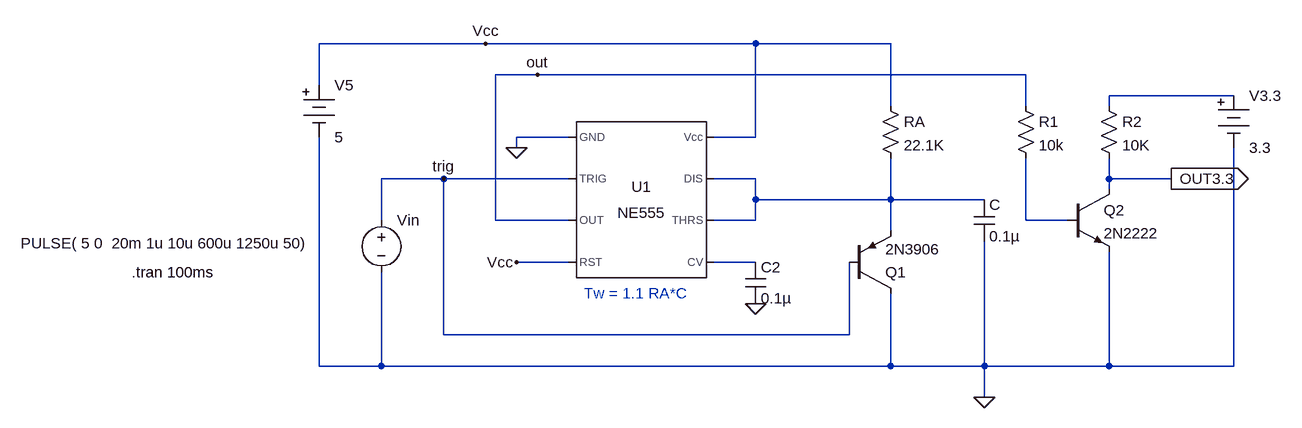
[diagram p0: schematic interface audio morse.asc]
interface audio morse.asc, the LTspice schematic file:
Version 4
SHEET 1 1524 1016
WIRE -96 -80 -352 -80
WIRE 320 -80 -96 -80
WIRE 528 -80 320 -80
WIRE -16 -32 -80 -32
WIRE 736 -32 -16 -32
WIRE -352 -16 -352 -80
WIRE 1056 0 864 0
WIRE 528 16 528 -80
WIRE 736 16 736 -32
WIRE 864 16 864 0
WIRE 32 64 -48 64
WIRE 320 64 320 -80
WIRE 320 64 256 64
WIRE -48 80 -48 64
WIRE -160 128 -256 128
WIRE 32 128 -160 128
WIRE 320 128 256 128
WIRE 864 128 864 96
WIRE 960 128 864 128
WIRE 864 144 864 128
WIRE 320 160 320 128
WIRE 528 160 528 96
WIRE 528 160 320 160
WIRE 672 160 528 160
WIRE -256 192 -256 128
WIRE -80 192 -80 -32
WIRE 32 192 -80 192
WIRE 320 192 320 160
WIRE 320 192 256 192
WIRE 736 192 736 96
WIRE 800 192 736 192
WIRE 528 208 528 160
WIRE 32 256 -48 256
WIRE 320 256 256 256
WIRE -160 368 -160 128
WIRE 464 368 464 256
WIRE 464 368 -160 368
WIRE -352 416 -352 64
WIRE -256 416 -256 272
WIRE -256 416 -352 416
WIRE 528 416 528 304
WIRE 528 416 -256 416
WIRE 672 416 672 224
WIRE 672 416 528 416
WIRE 864 416 864 240
WIRE 864 416 672 416
WIRE 1056 416 1056 80
WIRE 1056 416 864 416
WIRE 672 464 672 416
FLAG -48 80 0
FLAG 320 320 0
FLAG 672 464 0
FLAG -160 128 trig
FLAG -16 -32 out
FLAG 960 128 OUT3.3
IOPIN 960 128 Out
FLAG -48 256 Vcc
FLAG -96 -80 Vcc
SYMBOL Misc\\NE555 144 160 R0
SYMATTR InstName U1
SYMBOL Misc\\battery -352 -32 R0
WINDOW 123 0 0 Left 0
WINDOW 39 0 0 Left 0
SYMATTR InstName V5
SYMATTR Value 5
SYMBOL cap 656 160 R0
SYMATTR InstName C
SYMATTR Value 0.1µ
SYMATTR SpiceLine V=50 Irms=1.34 Rser=0.0989014 Lser=0 mfg="KEMET" pn="C0805C104K5RAC" type="X7R"
SYMBOL res 512 0 R0
SYMATTR InstName RA
SYMATTR Value 22.1K
SYMATTR SpiceLine tol=1 pwr=0.1
SYMBOL cap 304 256 R0
SYMATTR InstName C2
SYMATTR Value 0.1µ
SYMATTR SpiceLine V=4 Irms=0 Rser=0 Lser=0 mfg="Murata" pn="GRM032R60G104KE15" type="X5R"
SYMBOL voltage -256 176 R0
WINDOW 3 -555 51 Left 2
WINDOW 123 0 0 Left 0
WINDOW 39 0 0 Left 0
SYMATTR Value PULSE( 5 0  20m 1u 10u 600u 1250u 50)
SYMATTR InstName Vin
SYMBOL pnp 464 304 M180
SYMATTR InstName Q1
SYMATTR Value 2N3906
SYMBOL res 720 0 R0
SYMATTR InstName R1
SYMATTR Value 10k
SYMATTR SpiceLine tol=1 pwr=0.1
SYMBOL res 848 0 R0
SYMATTR InstName R2
SYMATTR Value 10K
SYMATTR SpiceLine tol=1 pwr=0.1
SYMBOL Misc\\battery 1056 -16 R0
WINDOW 123 0 0 Left 0
WINDOW 39 0 0 Left 0
SYMATTR InstName V3.3
SYMATTR Value 3.3
SYMBOL npn 800 144 R0
SYMATTR InstName Q2
SYMATTR Value 2N2222
TEXT -640 272 Left 2 !.tran 100ms
TEXT 56 304 Left 2 ;Tw = 1.1 RA*C

The netlist it stands for:
* interface audio morse.asc
XU1 0 trig out Vcc N004 N002 N002 Vcc NE555  ; pins GND TRIG OUT RST CV THRS DIS Vcc
V5 Vcc 0 5
C N002 0 0.1µ V=50 Irms=1.34 Rser=0.0989014 Lser=0 mfg="KEMET" pn="C0805C104K5RAC" type="X7R"
RA Vcc N002 22.1K tol=1 pwr=0.1
C2 N004 0 0.1µ V=4 Irms=0 Rser=0 Lser=0 mfg="Murata" pn="GRM032R60G104KE15" type="X5R"
Vin trig 0 PULSE( 5 0  20m 1u 10u 600u 1250u 50)
Q1 0 trig N002 0 2N3906
R1 out N003 10k tol=1 pwr=0.1
R2 N001 OUT3.3 10K tol=1 pwr=0.1
V3.3 N001 0 3.3
Q2 OUT3.3 N003 0 0 2N2222
.model NPN NPN
.model PNP PNP
.lib standard.bjt
.tran 100ms
* Tw = 1.1 RA*C
.lib NE555.sub
.backanno
.end